# EAGLE design SMD_cree_driver_led-mosfet0024-GoldPhoenix (EAGLE 6.4)
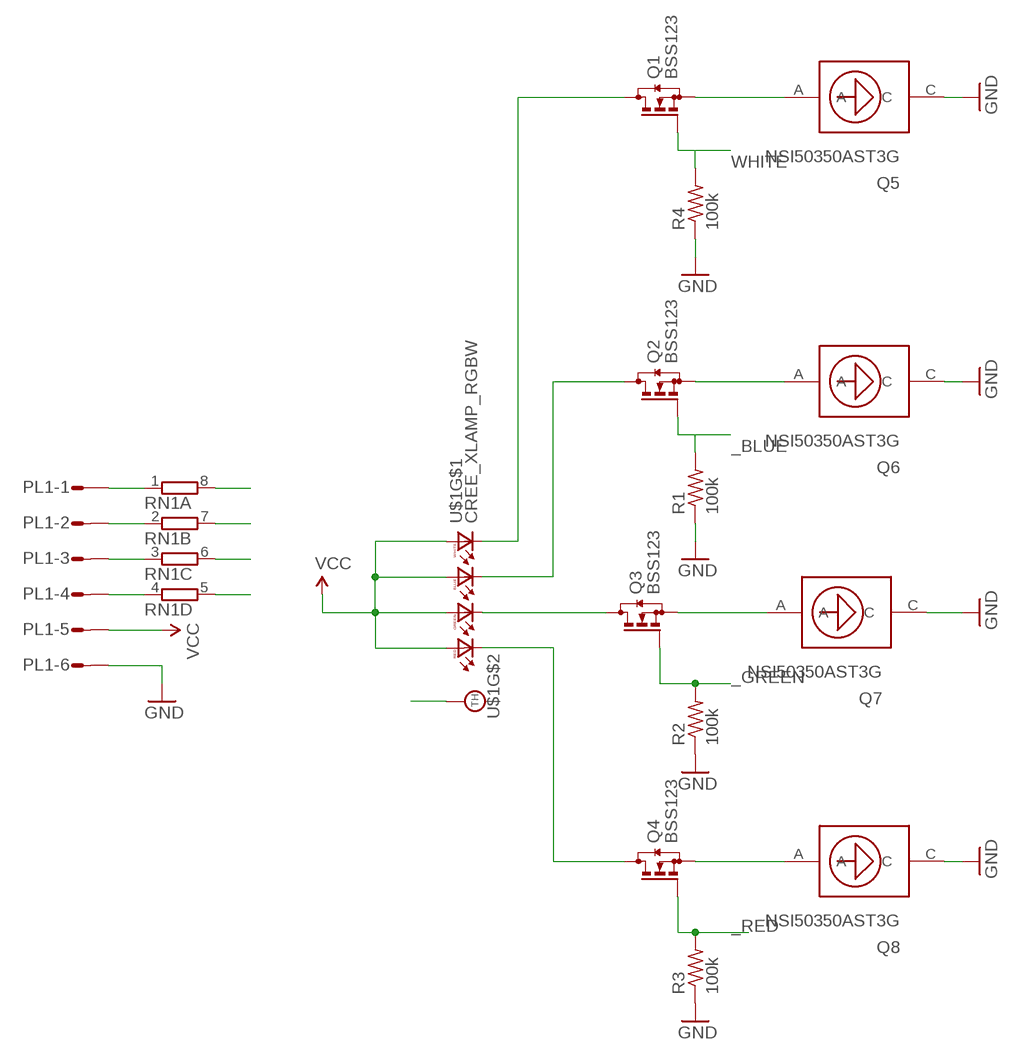
[diagram p0: schematic, sheet 1]

## Parts
PL1  DF3-06R  [DF3R-06]
Q1  BSS123  [SOT23]
Q2  BSS123  [SOT23]
Q3  BSS123  [SOT23]
Q4  BSS123  [SOT23]
Q5  NSI50350AST3G  [SMC-2]
Q6  NSI50350AST3G  [SMC-2]
Q7  NSI50350AST3G  [SMC-2]
Q8  NSI50350AST3G  [SMC-2]
R1  100k  R-US_R0402  [R0402]
R2  100k  R-US_R0402  [R0402]
R3  100k  R-US_R0402  [R0402]
R4  100k  R-US_R0402  [R0402]
RN1  4R-N0603-ARC  [0603-ARC]
U$1  CREE_XLAMP_RGBW  [CREE_XLAMP_XML]

## Nets
_BLUE [sig]: Q2.1(G) R1.2 RN1.6
_GREEN [sig]: Q3.1(G) R2.2 RN1.5
_RED [sig]: Q4.1(G) R3.2 RN1.7
BLUE_DRIVER: Q2.3(D) U$1.6(BC)
BLUE_PWM_IN [sig]: PL1.3 RN1.3
GND: PL1.6 Q5.C Q6.C Q7.C Q8.C R1.1 R2.1 R3.1 R4.1
GREEN_DRIVER: Q3.3(D) U$1.7(GC)
GREEN_PWM_IN [sig]: PL1.4 RN1.4
N$4: Q2.2(S) Q6.A
N$6: Q4.2(S) Q8.A
N$7: Q3.2(S) Q7.A
N$12: Q1.2(S) Q5.A
RED_DRIVER: Q4.3(D) U$1.8(RC)
RED_PWM_IN [sig]: PL1.2 RN1.2
THERM: U$1.P$1(TH)
VCC: PL1.5 U$1.1(RA) U$1.2(GA) U$1.3(BA) U$1.4(WA)
WHITE [sig]: Q1.1(G) R4.2 RN1.8
WHITE_DRIVER: Q1.3(D) U$1.5(WC)
WHITE_PWM_IN: PL1.1 RN1.1

## Library data of the parts
PL1 = con-hirose-df3:DF3-06: Single row connector 2mm 6 way
Q1-Q4 = transistor-small-signal:BSS123: N-CHANNEL MOS FET
Q5-Q8 = on-semiconductor:NSI50350AST3G
R1-R4 = resistor:R-US_: RESISTOR, American symbol
RN1 = resistor-dil:4R-N: Array Chip Resistor Source: RS Component / Phycomp; OC_FARNELL: unknown; OC_NEWARK: unknown
U$1 = led:CREE_XLAMP_RGBW: Cree XLAMP XM-L Color RGBW led http://www.mouser.com/ds/2/90/XLampXML_Color-218132.pdf

## Net classes
0 default: width 0.813 mm
1 sig: width 0.305 mm

## Board
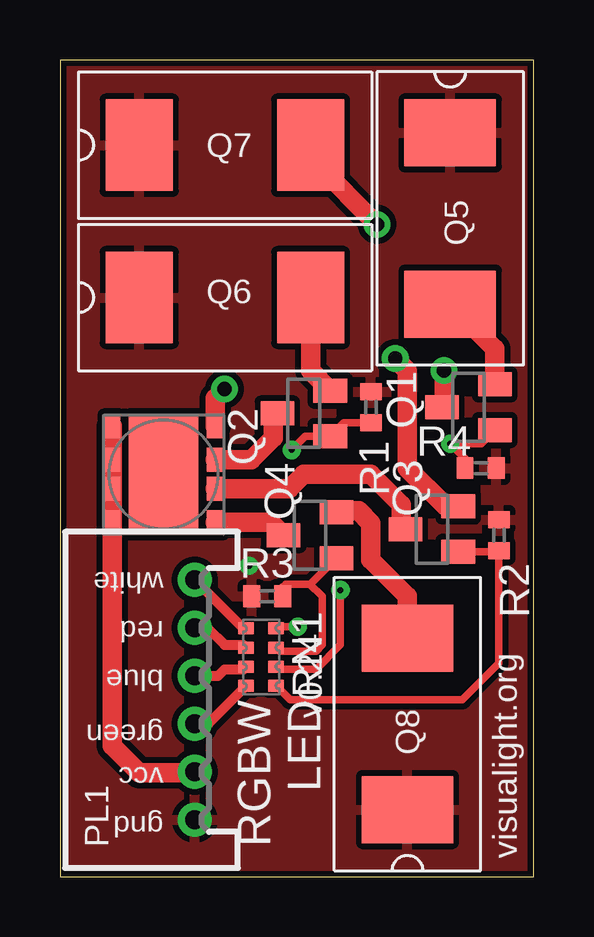
[diagram p1: board, top side]
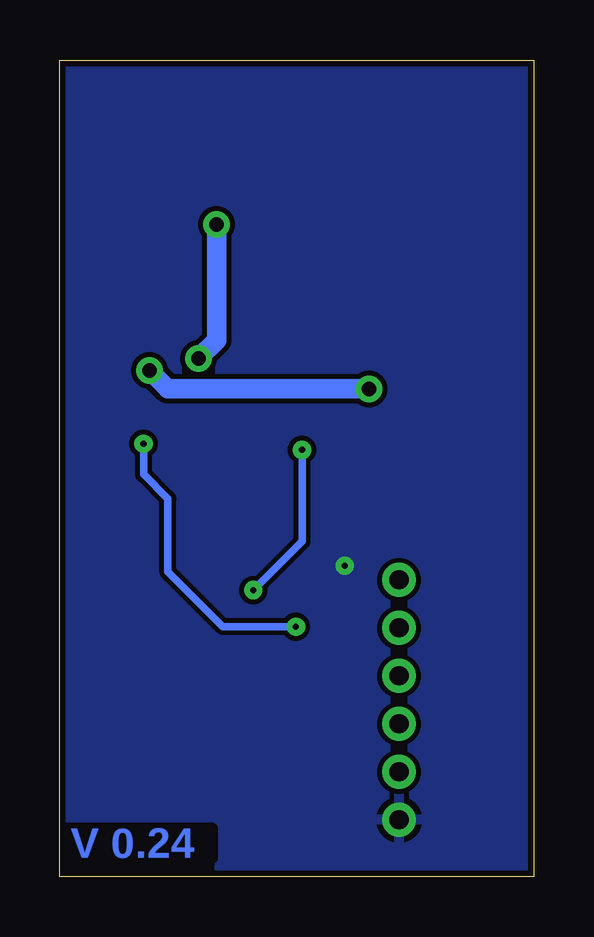
[diagram p2: board, bottom side, seen from below]

Size 19.74 x 34.03 mm. Coordinates in mm from the lower left corner, seen from the top.
Outline: 0,0 19.74,0 19.74,34.03 0,34.03 0,0
Copper layers (1*16): Top 0.035mm / dielectric 1.5mm / Bottom 0.035mm
Design rules "default": minimum track width 8mil, minimum drill 20mil, track to track 8mil, track to pad 8mil, pad to pad 8mil, via to via 8mil, smd to smd 8mil, copper to edge 10mil, drill to drill 8mil, minimum pad ring 12mil, minimum via ring 10mil, stop-mask expansion 4mil, vias tented up to drill 25mil, thermal gap 10mil

### Footprints (pad centres in the part's own frame; a part is rotated, then mirrored left to right if it is on the bottom)
DF3R-06 = drill 0.8: 1 -5,1.8; 2 -3,1.8; 3 -1,1.8; 4 1,1.8; 5 3,1.8; 6 5,1.8
SOT23 = smd 1 x 1.4: 1 -0.95,-1.1; 2 0.95,-1.1; 3 0,1.1
SMC-2 = smd 2.794 x 3.81: A 7.137,0; C 0,0
R0402 = smd 0.7 x 0.9: 1 -0.65,0; 2 0.65,0
0603-ARC = smd 0.5 x 0.65: 1 -1.2,-0.625; 2 -0.4,-0.625; 3 0.4,-0.625; 4 1.2,-0.625; 5 1.2,0.625; 6 0.4,0.625; 7 -0.4,0.625; 8 -1.2,0.625
CREE_XLAMP_XML = smd 0.7 x 1: 1 2.15,2; 2 2.15,0.6; 3 2.15,-0.6; 4 2.15,-2; 5 -2.15,-2; 6 -2.15,-0.6; 7 -2.15,0.6; 8 -2.15,2 | smd 2.9 x 5: P$1 0,0

### Placement (x,y rotation side)
PL1  3.81,7.37 270 top
Q1  17.02,19.56 90 top
Q2  10.16,19.3 90 top
Q3  15.49,14.48 90 top
Q4  10.41,14.22 90 top
Q5  16.26,30.99 270 top
Q6  3.3,24.13 0 top
Q7  3.3,30.48 0 top
Q8  14.48,2.79 90 top
R1  12.95,19.56 270 top
R2  18.29,14.22 270 top
R3  8.64,11.68 0 top
R4  17.53,17.02 180 top
RN1  8.38,9.14 270 top
U$1  4.32,16.76 180 top

### Tracks (layer width: path | path; a pad name or v marks a point on that pad's centre or on a via)
_BLUE  (via drill 0.25)
  Top 0.305: RN1.6 9.12,8.64 10.67,8.64 11.68,9.65 v11.68,11.94 | v9.65,17.78 10.23,18.35 Q2.1 11.81,18.91 R1.2
  Bottom 0.305: v11.68,11.94 9.65,13.97 v9.65,17.78
_GREEN
  Top 0.305: RN1.5 9.59,7.37 16.76,7.37 18.29,8.89 R2.2 18.24,13.53 Q3.1
_RED
  Top 0.305: RN1.7 9.15,9.4 10.67,9.4 10.92,9.65 10.92,11.68 10.41,12.19 | 10.41,12.19 9.4,12.19 9.29,12.08 R3.2 | Q4.1 10.43,12.19 10.41,12.19
BLUE_DRIVER
  Top 0.813: U$1.6 7.97,17.36 8.89,18.29 8.89,19.13 Q2.3
BLUE_PWM_IN
  Top 0.406: PL1.3 6.59,8.37 6.86,8.64 7.65,8.64 RN1.3
GND  (via drill 0.25)
  other vias: 7.87,12.95
  pour Bottom: 0,34.04 20.57,34.04 20.57,0 0,0
  pour Top (isolate 0.254): 0,34.04 20.57,34.04 20.57,0 0,0
GREEN_DRIVER
  Top 0.813: U$1.7 9.56,16.16 10.16,16.76 12.95,16.76 14.22,15.49 14.22,14.65 Q3.3
GREEN_PWM_IN
  Top 0.406: PL1.4 6.18,6.37 RN1.4
N$4
  Top 0.813: Q6.A 10.44,21.07 Q2.2
N$6
  Top 0.813: Q8.A 14.48,11.68 12.95,13.21 12.95,14.73 12.45,15.24 11.58,15.24 Q4.2
N$7  (via drill 0.6)
  Top 0.813: Q3.2 16.07,15.43 14.48,17.02 14.48,21.08 v13.97,21.59 | v13.21,27.18 10.67,29.72 10.41,29.72 10.44,29.74 Q7.A
  Bottom 0.813: v13.97,21.59 13.21,22.35 v13.21,27.18
N$12
  Top 0.813: Q1.2 18.12,21.99 Q5.A
RED_DRIVER
  Top 0.813: U$1.8 8.77,14.76 Q4.3
RED_PWM_IN
  Top 0.406: PL1.2 6.14,10.37 6.86,9.65 7.65,9.65 RN1.2
VCC
  Top 0.813: U$1.4 U$1.3 U$1.2 U$1.1 2.17,5.45 3.3,4.32 5.56,4.32 PL1.5
WHITE  (via drill 0.25)
  Top 0.305: RN1.8 9.08,10.41 v9.91,10.41 | R4.2 16.88,17.41 v16.26,18.03 17.54,18.03 Q1.1
  Bottom 0.305: v16.26,18.03 16.26,16.76 15.24,15.75 15.24,12.7 12.95,10.41 v9.91,10.41
WHITE_DRIVER  (via drill 0.6)
  Top 0.813: U$1.5 6.47,19.93 v6.86,20.32 | v16,21.08 16,19.64 Q1.3
  Bottom 0.813: v6.86,20.32 15.24,20.32 v16,21.08
WHITE_PWM_IN
  Top 0.406: RN1.1 7.63,10.34 PL1.1

### Text on the board
Bottom: V 0.24
tPlace: white | red | blue | RGBW / LED | v0.24 | green | vcc | gnd | visualight.org